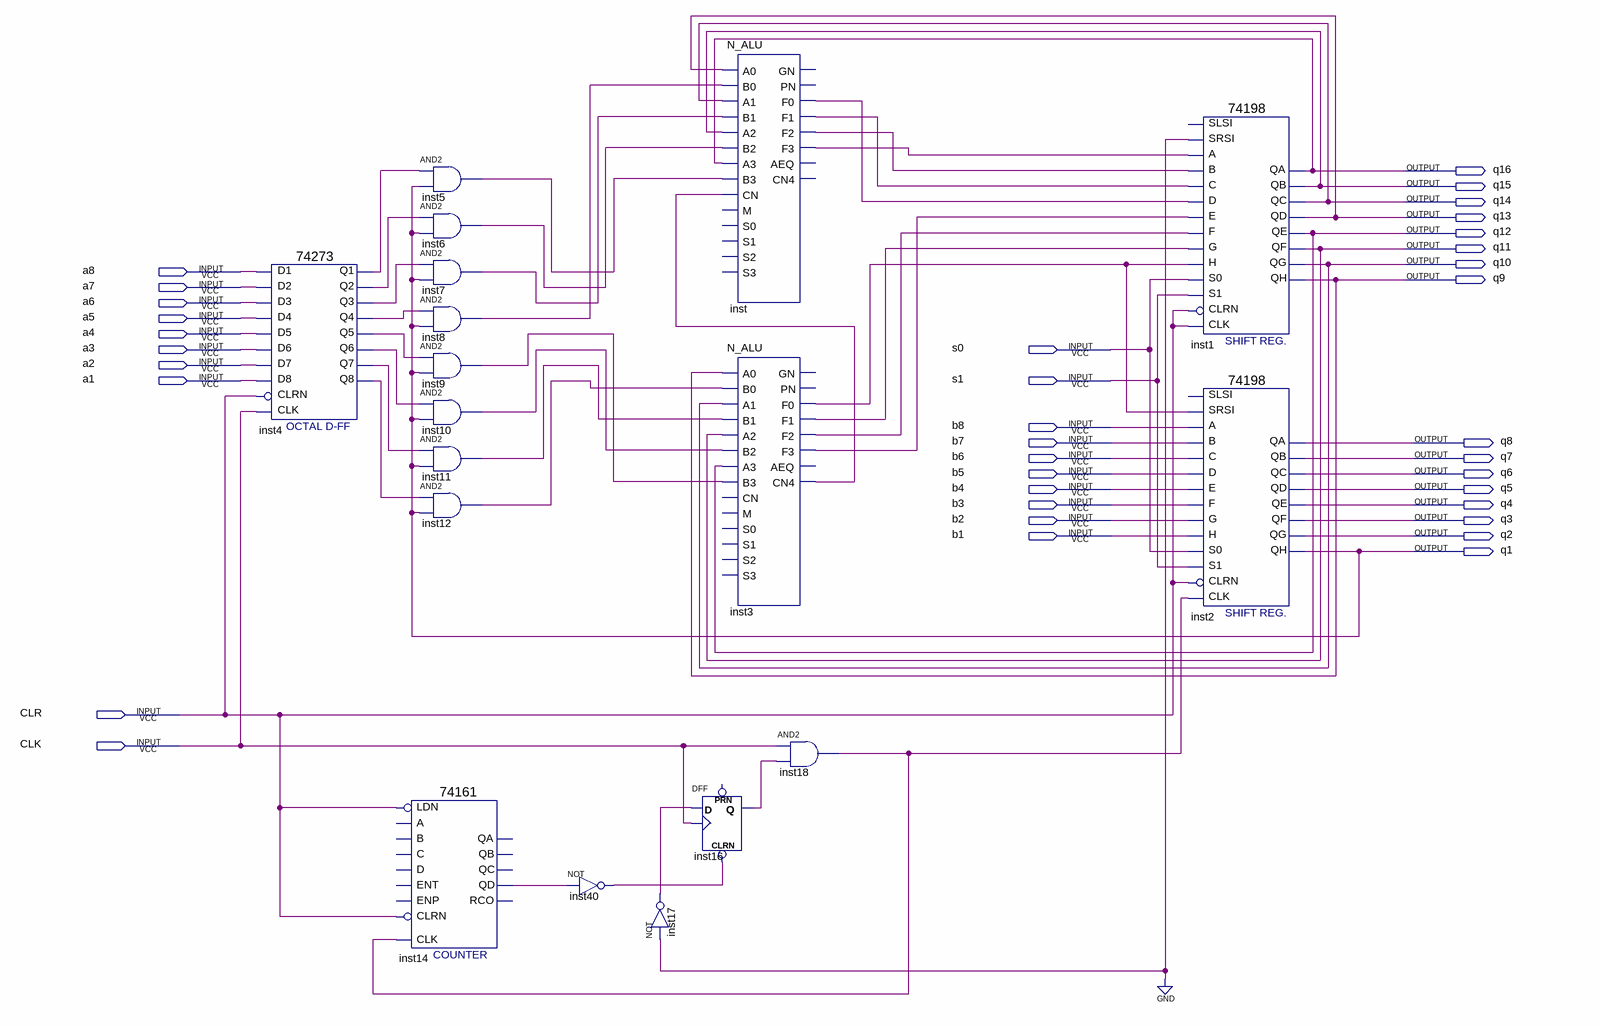
[diagram p0: schematic sheet]
// Quartus schematic Block1.bdf as structural Verilog: 18 symbols, 36 pins
module Block1 (
  input  a8,
  input  a7,
  input  a6,
  input  a5,
  input  a4,
  input  a3,
  input  s0,
  input  a2,
  input  a1,
  input  s1,
  input  b8,
  input  b7,
  input  b6,
  input  b5,
  input  b4,
  input  b3,
  input  b2,
  input  b1,
  input  CLR,
  input  CLK,
  output q16,
  output q15,
  output q14,
  output q13,
  output q12,
  output q11,
  output q10,
  output q9,
  output q8,
  output q7,
  output q6,
  output q5,
  output q4,
  output q3,
  output q2,
  output q1
);

  wire inst3_cn4, inst3_f0, inst3_f1, inst3_f2, inst3_f3, inst4_q1, inst4_q2, inst4_q3, inst4_q4, inst4_q5,
       inst4_q6, inst4_q7, inst4_q8, inst5_out, inst6_out, inst7_out, inst8_out, inst9_out, inst10_out,
       inst11_out, inst12_out, inst14_qd, inst16_q, inst17_out, inst18_out, inst40_out, inst_f0, inst_f1,
       inst_f2, inst_f3;

  \74273  inst4 (
    .D2(a7), .D3(a6), .D1(a8), .D4(a5), .D7(a2), .D6(a3), .D5(a4), .D8(a1), .CLK(CLK), .CLRN(CLR),
    .Q4(inst4_q4), .Q1(inst4_q1), .Q2(inst4_q2), .Q3(inst4_q3), .Q6(inst4_q6), .Q5(inst4_q5), .Q7(inst4_q7),
    .Q8(inst4_q8));
  and inst5 (inst5_out, inst4_q1, q1);
  and inst6 (inst6_out, inst4_q2, q1);
  and inst7 (inst7_out, inst4_q3, q1);
  and inst8 (inst8_out, inst4_q4, q1);
  and inst9 (inst9_out, inst4_q5, q1);
  and inst10 (inst10_out, inst4_q6, q1);
  and inst11 (inst11_out, inst4_q7, q1);
  and inst12 (inst12_out, inst4_q8, q1);
  \74161  inst14 (
    .CLRN(CLR), .CLK(inst18_out), .LDN(CLR), .QD(inst14_qd));  // open: ENP, A, D, ENT, B, C, QC, QB, QA, RCO
  not inst40 (inst40_out, inst14_qd);
  DFF inst16 (.CLRN(inst40_out), .CLK(CLK), .D(inst17_out), .Q(inst16_q));  // open: PRN
  not inst17 (inst17_out, 1'b0);
  N_ALU inst (
    .A0(q13), .B0(inst8_out), .A1(q14), .B1(inst7_out), .A2(q15), .B2(inst6_out), .A3(q16), .B3(inst5_out),
    .CN(inst3_cn4), .F0(inst_f0), .F1(inst_f1), .F2(inst_f2), .F3(inst_f3));  // open: M, S0, S1, S2, S3, GN, PN, AEQ, CN4
  N_ALU inst3 (
    .A0(q9), .B0(inst12_out), .A1(q10), .B1(inst11_out), .A2(q11), .B2(inst10_out), .A3(q12), .B3(inst9_out),
    .F0(inst3_f0), .F1(inst3_f1), .F2(inst3_f2), .F3(inst3_f3), .CN4(inst3_cn4));  // open: CN, M, S0, S1, S2, S3, GN, PN, AEQ
  and inst18 (inst18_out, CLK, inst16_q);
  \74198  inst1 (
    .A(inst_f3), .SRSI(1'b0), .E(inst3_f3), .S0(s0), .B(inst_f2), .C(inst_f1), .D(inst_f0), .H(inst3_f0),
    .G(inst3_f1), .CLRN(CLR), .CLK(CLR), .F(inst3_f2), .S1(s1), .QD(q13), .QC(q14), .QH(q9), .QA(q16),
    .QB(q15), .QE(q12), .QF(q11), .QG(q10));  // open: SLSI
  \74198  inst2 (
    .A(b8), .SRSI(inst3_f0), .E(b4), .S0(s0), .B(b7), .C(b6), .D(b5), .H(b1), .G(b2), .CLRN(CLR),
    .CLK(inst18_out), .F(b3), .S1(s1), .QD(q5), .QC(q6), .QH(q1), .QA(q8), .QB(q7), .QE(q4), .QF(q3), .QG(q2));  // open: SLSI
endmodule
